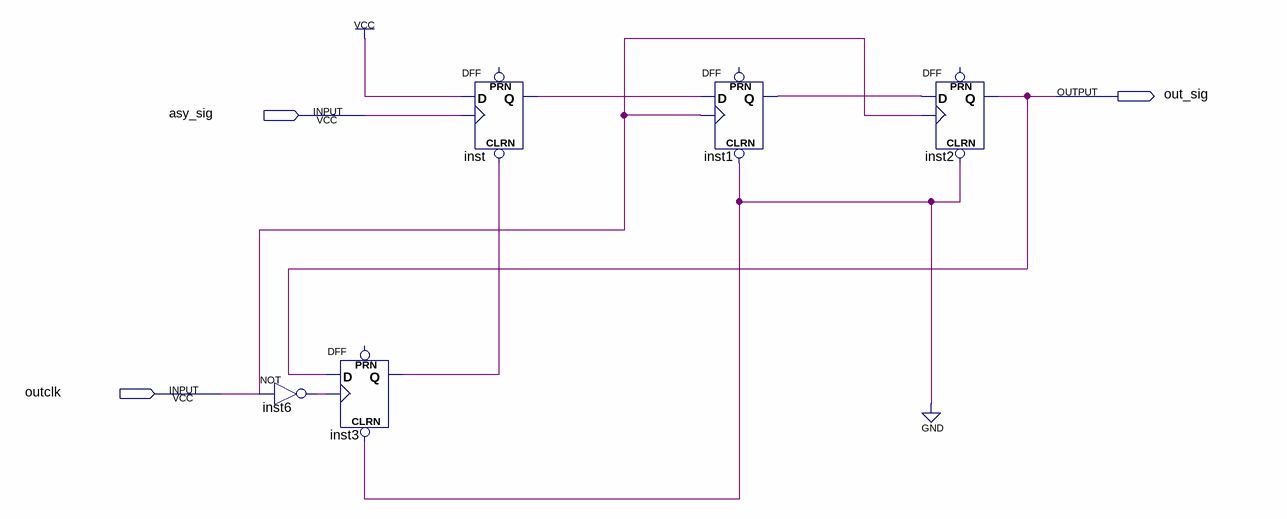
[diagram p0: schematic sheet]
// Quartus schematic q7.bdf as structural Verilog: 5 symbols, 3 pins
module q7 (
  input  asy_sig,
  input  outclk,
  output out_sig
);

  wire inst1_q, inst3_q, inst6_out, inst_q;

  not inst6 (inst6_out, outclk);
  DFF inst3 (.CLRN(1'b0), .CLK(inst6_out), .D(out_sig), .Q(inst3_q));  // open: PRN
  DFF inst (.CLRN(inst3_q), .CLK(asy_sig), .D(1'b1), .Q(inst_q));  // open: PRN
  DFF inst1 (.CLRN(1'b0), .CLK(outclk), .D(inst_q), .Q(inst1_q));  // open: PRN
  DFF inst2 (.CLRN(1'b0), .CLK(outclk), .D(inst1_q), .Q(out_sig));  // open: PRN
endmodule
